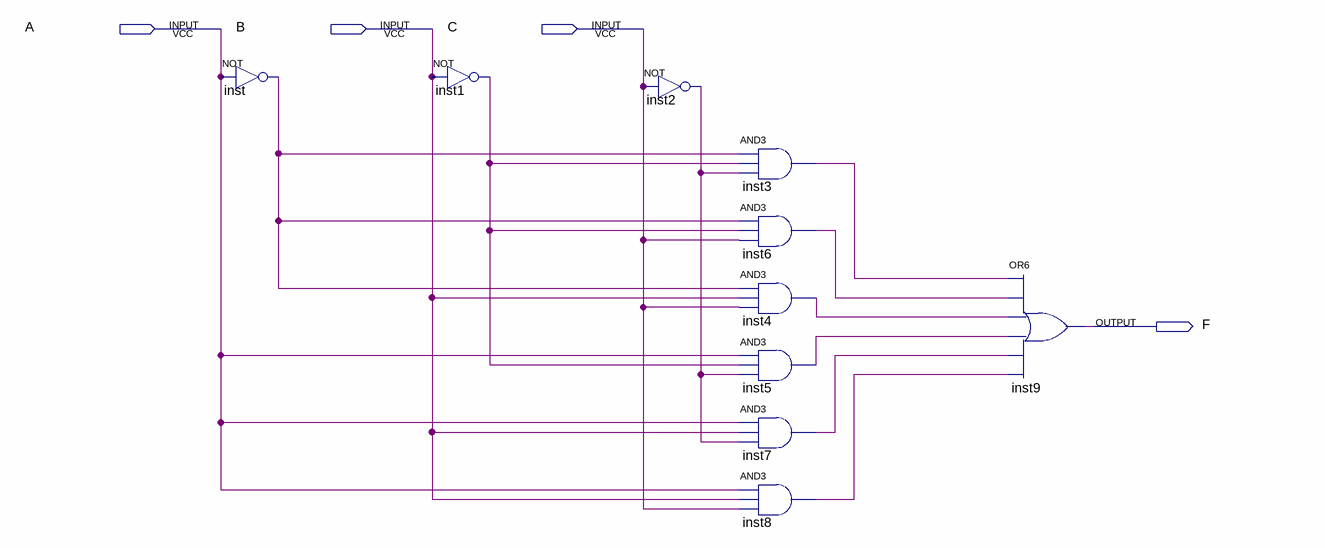
[diagram p0: schematic sheet]
// Quartus schematic lab2step2.bdf as structural Verilog: 10 symbols, 4 pins
module lab2step2 (
  input  A,
  input  B,
  input  C,
  output F
);

  wire inst1_out, inst2_out, inst3_out, inst4_out, inst5_out, inst6_out, inst7_out, inst8_out, inst_out;

  not inst (inst_out, A);
  not inst1 (inst1_out, B);
  not inst2 (inst2_out, C);
  and inst3 (inst3_out, inst_out, inst1_out, inst2_out);
  and inst6 (inst6_out, inst_out, inst1_out, C);
  and inst4 (inst4_out, inst_out, B, C);
  and inst5 (inst5_out, A, inst1_out, inst2_out);
  and inst7 (inst7_out, A, B, inst2_out);
  and inst8 (inst8_out, A, B, C);
  or inst9 (F, inst3_out, inst6_out, inst4_out, inst5_out, inst7_out, inst8_out);
endmodule
